# Altium project mini_backplane_simple.PrjPcb
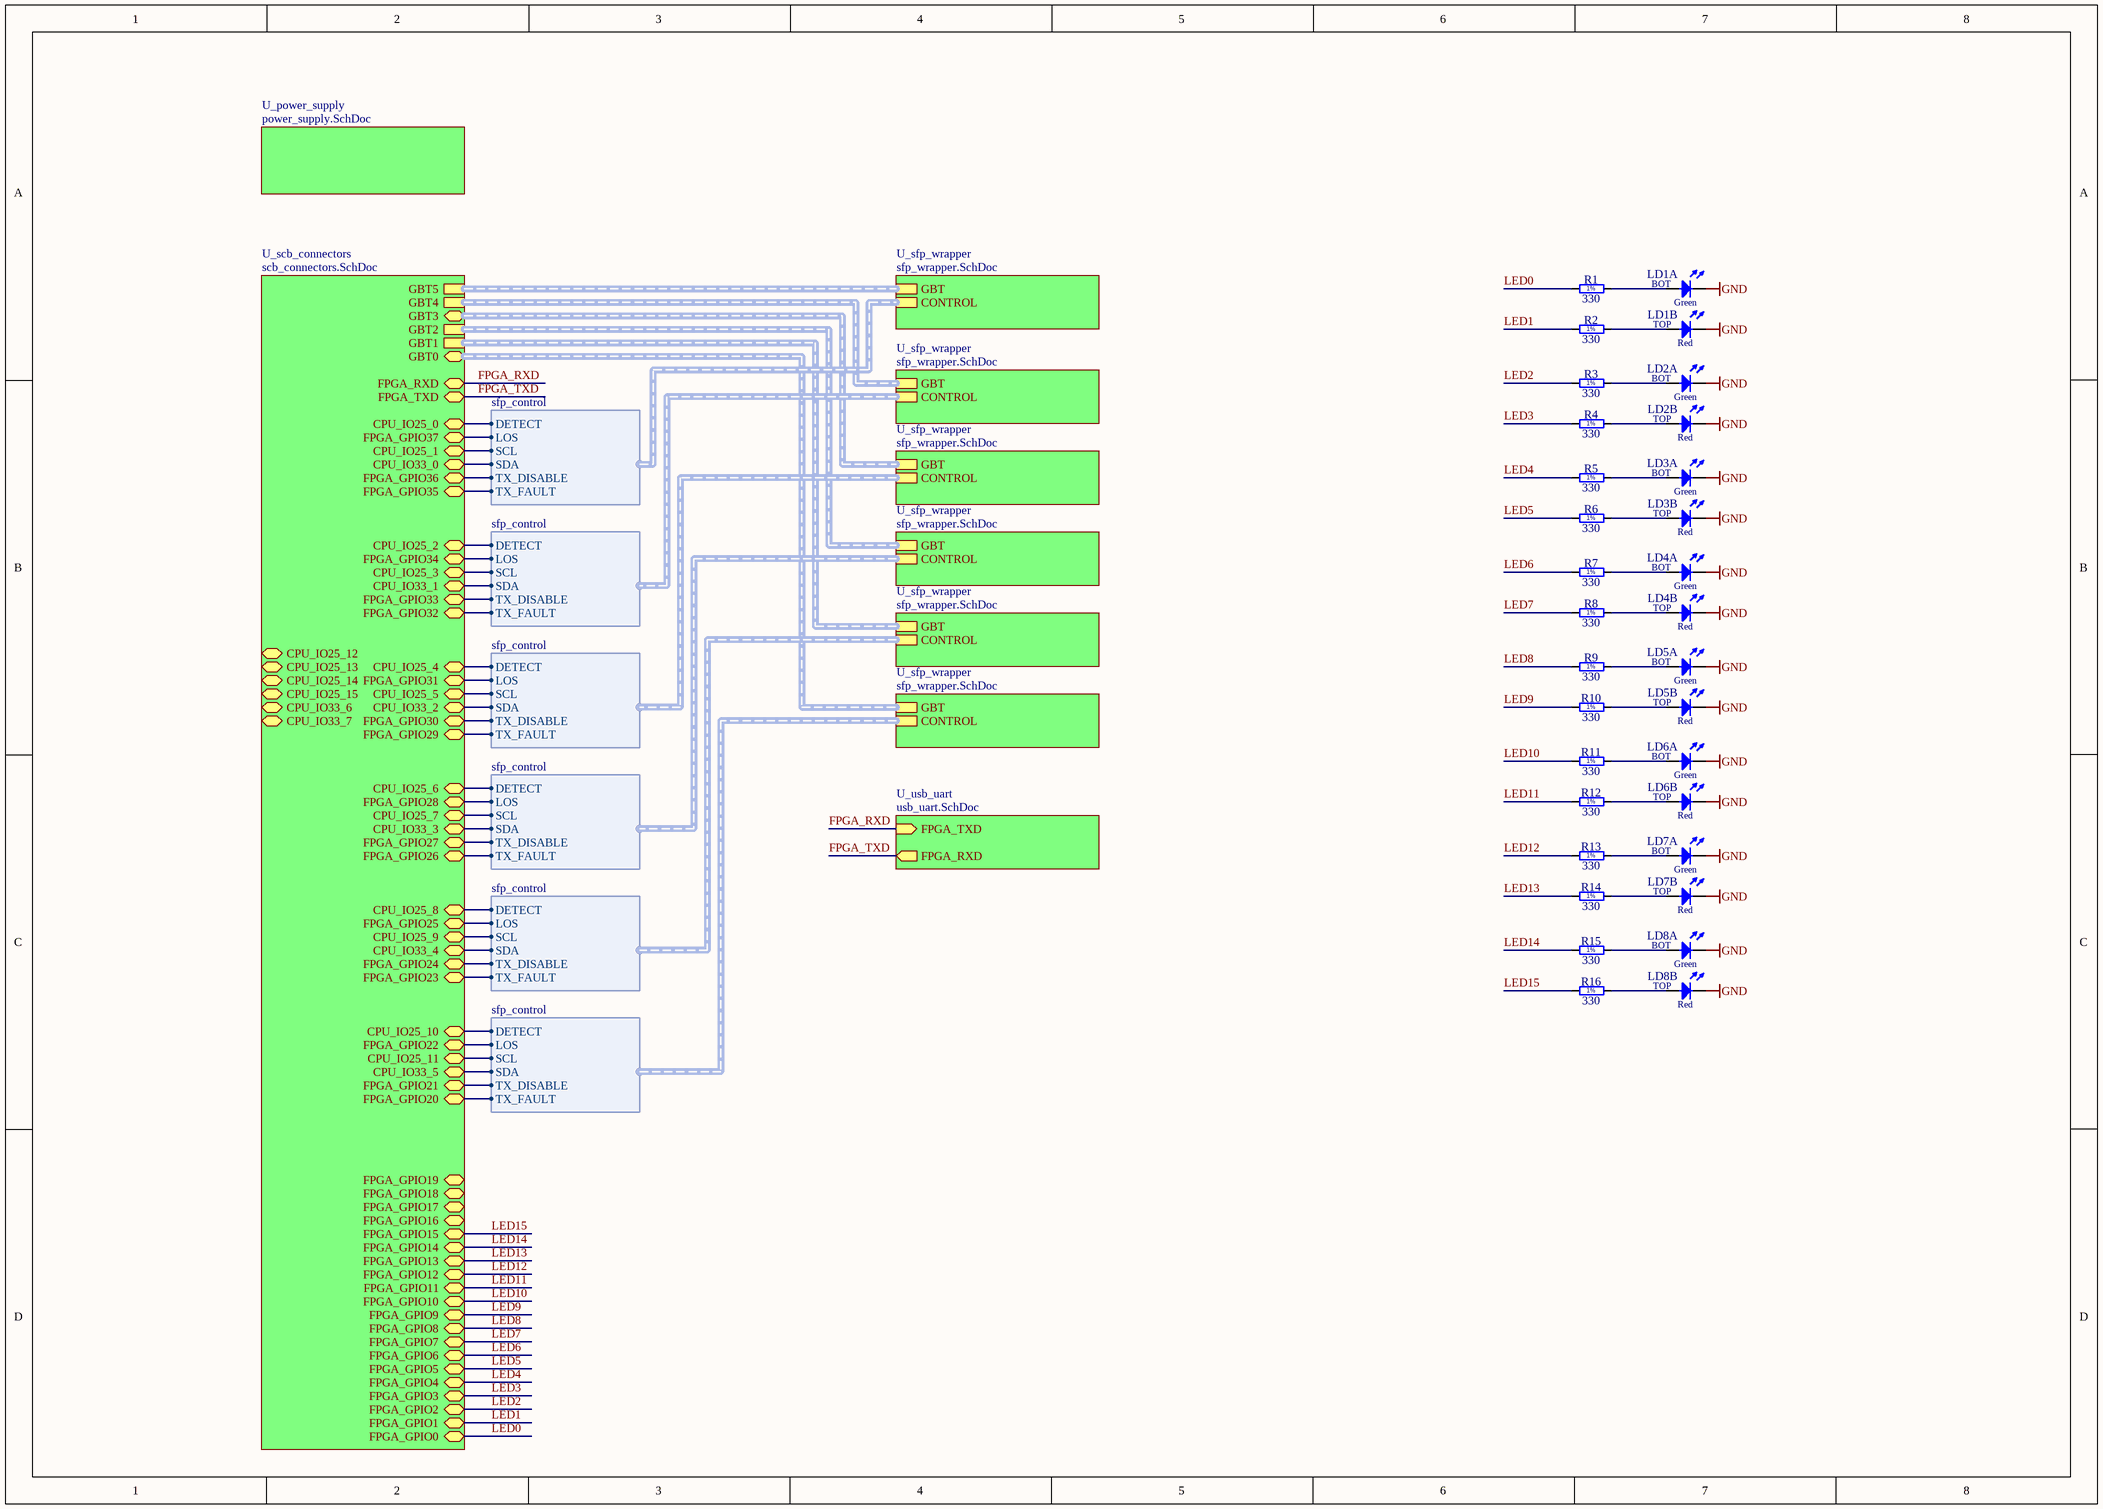
[diagram p0: mini_backplane.SchDoc]
Projet: Simple mini-backplane for V3 SCB; DivGrp: BE-CO
5 sheets, 147 parts. Net scope: hierarchical (ports join the sheet entries above them; power ports are global).
Board file: mini_backplane.PcbDoc
Sheets:
  mini_backplane.SchDoc
    U_power_supply = power_supply.SchDoc
    U_scb_connectors = scb_connectors.SchDoc
    U_sfp_wrapper = sfp_wrapper.SchDoc
    U_sfp_wrapper = sfp_wrapper.SchDoc
    U_sfp_wrapper = sfp_wrapper.SchDoc
    U_sfp_wrapper = sfp_wrapper.SchDoc
    U_sfp_wrapper = sfp_wrapper.SchDoc
    U_sfp_wrapper = sfp_wrapper.SchDoc
    U_usb_uart = usb_uart.SchDoc

## Sheet mini_backplane.SchDoc
size A3

### Parts
LD1  Red/Green  [LED_DIALIGHT_571-0112-100F]  (value not drawn)  (parts A,B of 2)
LD2  Red/Green  [LED_DIALIGHT_571-0112-100F]  (value not drawn)  (parts A,B of 2)
LD3  Red/Green  [LED_DIALIGHT_571-0112-100F]  (value not drawn)  (parts A,B of 2)
LD4  Red/Green  [LED_DIALIGHT_571-0112-100F]  (value not drawn)  (parts A,B of 2)
LD5  Red/Green  [LED_DIALIGHT_571-0112-100F]  (value not drawn)  (parts A,B of 2)
LD6  Red/Green  [LED_DIALIGHT_571-0112-100F]  (value not drawn)  (parts A,B of 2)
LD7  Red/Green  [LED_DIALIGHT_571-0112-100F]  (value not drawn)  (parts A,B of 2)
LD8  Red/Green  [LED_DIALIGHT_571-0112-100F]  (value not drawn)  (parts A,B of 2)
R1  330  [RESC1608X55N]
R2  330  [RESC1608X55N]
R3  330  [RESC1608X55N]
R4  330  [RESC1608X55N]
R5  330  [RESC1608X55N]
R6  330  [RESC1608X55N]
R7  330  [RESC1608X55N]
R8  330  [RESC1608X55N]
R9  330  [RESC1608X55N]
R10  330  [RESC1608X55N]
R11  330  [RESC1608X55N]
R12  330  [RESC1608X55N]
R13  330  [RESC1608X55N]
R14  330  [RESC1608X55N]
R15  330  [RESC1608X55N]
R16  330  [RESC1608X55N]

### Sub-sheets
U_power_supply = power_supply.SchDoc: no entries
U_scb_connectors = scb_connectors.SchDoc: FPGA_GPIO0 (bidir), FPGA_GPIO1 (bidir), FPGA_GPIO2 (bidir), FPGA_GPIO3 (bidir), FPGA_GPIO4 (bidir), FPGA_GPIO5 (bidir), FPGA_GPIO6 (bidir), FPGA_GPIO7 (bidir), FPGA_GPIO8 (bidir), FPGA_GPIO9 (bidir), FPGA_GPIO10 (bidir), FPGA_GPIO11 (bidir), FPGA_GPIO12 (bidir), FPGA_GPIO13 (bidir), FPGA_GPIO14 (bidir), FPGA_GPIO15 (bidir), FPGA_GPIO16 (bidir), FPGA_GPIO17 (bidir), FPGA_GPIO18 (bidir), FPGA_GPIO19 (bidir), FPGA_GPIO20 (bidir), FPGA_GPIO21 (bidir), FPGA_GPIO22 (bidir), FPGA_GPIO23 (bidir), FPGA_GPIO24 (bidir), FPGA_GPIO25 (bidir), FPGA_GPIO26 (bidir), FPGA_GPIO27 (bidir), FPGA_GPIO28 (bidir), FPGA_GPIO29 (bidir), FPGA_GPIO30 (bidir), FPGA_GPIO31 (bidir), FPGA_GPIO32 (bidir), FPGA_GPIO33 (bidir), FPGA_GPIO34 (bidir), FPGA_GPIO35 (bidir), FPGA_GPIO36 (bidir), FPGA_GPIO37 (bidir), GBT1 (harness sfp_gbit), GBT2 (harness sfp_gbit), GBT4 (harness sfp_gbit), GBT5 (harness sfp_gbit), FPGA_RXD (bidir), FPGA_TXD (bidir), GBT0 (harness sfp_gbit), GBT3 (harness sfp_gbit), CPU_IO25_0 (bidir), CPU_IO25_1 (bidir), CPU_IO25_2 (bidir), CPU_IO25_3 (bidir), CPU_IO25_4 (bidir), CPU_IO25_5 (bidir), CPU_IO25_6 (bidir), CPU_IO25_7 (bidir), CPU_IO25_8 (bidir), CPU_IO25_9 (bidir), CPU_IO25_10 (bidir), CPU_IO25_11 (bidir), CPU_IO25_12 (bidir), CPU_IO25_13 (bidir), CPU_IO25_14 (bidir), CPU_IO25_15 (bidir), CPU_IO33_0 (bidir), CPU_IO33_1 (bidir), CPU_IO33_2 (bidir), CPU_IO33_3 (bidir), CPU_IO33_4 (bidir), CPU_IO33_5 (bidir), CPU_IO33_6 (bidir), CPU_IO33_7 (bidir)
U_sfp_wrapper = sfp_wrapper.SchDoc: GBT (harness sfp_gbit), CONTROL (harness sfp_control)
U_sfp_wrapper = sfp_wrapper.SchDoc: GBT (harness sfp_gbit), CONTROL (harness sfp_control)
U_sfp_wrapper = sfp_wrapper.SchDoc: GBT (harness sfp_gbit), CONTROL (harness sfp_control)
U_sfp_wrapper = sfp_wrapper.SchDoc: GBT (harness sfp_gbit), CONTROL (harness sfp_control)
U_sfp_wrapper = sfp_wrapper.SchDoc: GBT (harness sfp_gbit), CONTROL (harness sfp_control)
U_sfp_wrapper = sfp_wrapper.SchDoc: GBT (harness sfp_gbit), CONTROL (harness sfp_control)
U_usb_uart = usb_uart.SchDoc: FPGA_RXD (out), FPGA_TXD (in)

### Harnesses
sfp_control: DETECT, LOS, SCL, SDA, TX_DISABLE, TX_FAULT

### Nets
GND: LD1.1(C) LD1.3(C) LD2.1(C) LD2.3(C) LD3.1(C) LD3.3(C) LD4.1(C) LD4.3(C) LD5.1(C) LD5.3(C) LD6.1(C) LD6.3(C) LD7.1(C) LD7.3(C) LD8.1(C) LD8.3(C)
DETECT: sheet U_scb_connectors/CPU_IO25_0, sheet U_sfp_wrapper/CONTROL.DETECT
DETECT: sheet U_scb_connectors/CPU_IO25_2, sheet U_sfp_wrapper/CONTROL.DETECT  [a separate net that carries the same name]
DETECT: sheet U_scb_connectors/CPU_IO25_4, sheet U_sfp_wrapper/CONTROL.DETECT  [a separate net that carries the same name]
DETECT: sheet U_scb_connectors/CPU_IO25_6, sheet U_sfp_wrapper/CONTROL.DETECT  [a separate net that carries the same name]
DETECT: sheet U_scb_connectors/CPU_IO25_8, sheet U_sfp_wrapper/CONTROL.DETECT  [a separate net that carries the same name]
DETECT: sheet U_scb_connectors/CPU_IO25_10, sheet U_sfp_wrapper/CONTROL.DETECT  [a separate net that carries the same name]
FPGA_GPIO20: sheet U_scb_connectors/FPGA_GPIO20, sheet U_sfp_wrapper/CONTROL.TX_FAULT
FPGA_GPIO21: sheet U_scb_connectors/FPGA_GPIO21, sheet U_sfp_wrapper/CONTROL.TX_DISABLE
FPGA_GPIO22: sheet U_scb_connectors/FPGA_GPIO22, sheet U_sfp_wrapper/CONTROL.LOS
FPGA_GPIO23: sheet U_scb_connectors/FPGA_GPIO23, sheet U_sfp_wrapper/CONTROL.TX_FAULT
FPGA_GPIO24: sheet U_scb_connectors/FPGA_GPIO24, sheet U_sfp_wrapper/CONTROL.TX_DISABLE
FPGA_GPIO25: sheet U_scb_connectors/FPGA_GPIO25, sheet U_sfp_wrapper/CONTROL.LOS
FPGA_GPIO26: sheet U_scb_connectors/FPGA_GPIO26, sheet U_sfp_wrapper/CONTROL.TX_FAULT
FPGA_GPIO27: sheet U_scb_connectors/FPGA_GPIO27, sheet U_sfp_wrapper/CONTROL.TX_DISABLE
FPGA_GPIO28: sheet U_scb_connectors/FPGA_GPIO28, sheet U_sfp_wrapper/CONTROL.LOS
FPGA_GPIO29: sheet U_scb_connectors/FPGA_GPIO29, sheet U_sfp_wrapper/CONTROL.TX_FAULT
FPGA_GPIO30: sheet U_scb_connectors/FPGA_GPIO30, sheet U_sfp_wrapper/CONTROL.TX_DISABLE
FPGA_GPIO31: sheet U_scb_connectors/FPGA_GPIO31, sheet U_sfp_wrapper/CONTROL.LOS
FPGA_GPIO32: sheet U_scb_connectors/FPGA_GPIO32, sheet U_sfp_wrapper/CONTROL.TX_FAULT
FPGA_GPIO33: sheet U_scb_connectors/FPGA_GPIO33, sheet U_sfp_wrapper/CONTROL.TX_DISABLE
FPGA_GPIO34: sheet U_scb_connectors/FPGA_GPIO34, sheet U_sfp_wrapper/CONTROL.LOS
FPGA_GPIO35: sheet U_scb_connectors/FPGA_GPIO35, sheet U_sfp_wrapper/CONTROL.TX_FAULT
FPGA_GPIO36: sheet U_scb_connectors/FPGA_GPIO36, sheet U_sfp_wrapper/CONTROL.TX_DISABLE
FPGA_GPIO37: sheet U_scb_connectors/FPGA_GPIO37, sheet U_sfp_wrapper/CONTROL.LOS
FPGA_RXD: sheet U_scb_connectors/FPGA_RXD, sheet U_usb_uart/FPGA_TXD
FPGA_TXD: sheet U_scb_connectors/FPGA_TXD, sheet U_usb_uart/FPGA_RXD
LED0: R1.1 ; sheet U_scb_connectors/FPGA_GPIO0  [project net FPGA_GPIO0]
LED1: R2.1 ; sheet U_scb_connectors/FPGA_GPIO1  [project net FPGA_GPIO1]
LED2: R3.1 ; sheet U_scb_connectors/FPGA_GPIO2  [project net FPGA_GPIO2]
LED3: R4.1 ; sheet U_scb_connectors/FPGA_GPIO3  [project net FPGA_GPIO3]
LED4: R5.1 ; sheet U_scb_connectors/FPGA_GPIO4  [project net FPGA_GPIO4]
LED5: R6.1 ; sheet U_scb_connectors/FPGA_GPIO5  [project net FPGA_GPIO5]
LED6: R7.1 ; sheet U_scb_connectors/FPGA_GPIO6  [project net FPGA_GPIO6]
LED7: R8.1 ; sheet U_scb_connectors/FPGA_GPIO7  [project net FPGA_GPIO7]
LED8: R9.1 ; sheet U_scb_connectors/FPGA_GPIO8  [project net FPGA_GPIO8]
LED9: R10.1 ; sheet U_scb_connectors/FPGA_GPIO9  [project net FPGA_GPIO9]
LED10: R11.1 ; sheet U_scb_connectors/FPGA_GPIO10  [project net FPGA_GPIO10]
LED11: R12.1 ; sheet U_scb_connectors/FPGA_GPIO11  [project net FPGA_GPIO11]
LED12: R13.1 ; sheet U_scb_connectors/FPGA_GPIO12  [project net FPGA_GPIO12]
LED13: R14.1 ; sheet U_scb_connectors/FPGA_GPIO13  [project net FPGA_GPIO13]
LED14: R15.1 ; sheet U_scb_connectors/FPGA_GPIO14  [project net FPGA_GPIO14]
LED15: R16.1 ; sheet U_scb_connectors/FPGA_GPIO15  [project net FPGA_GPIO15]
PB0: sheet U_scb_connectors/CPU_IO33_4, sheet U_sfp_wrapper/CONTROL.SDA
PB1: sheet U_scb_connectors/CPU_IO33_2, sheet U_sfp_wrapper/CONTROL.SDA
PB2: sheet U_scb_connectors/CPU_IO33_3, sheet U_sfp_wrapper/CONTROL.SDA
PB3: sheet U_scb_connectors/CPU_IO33_1, sheet U_sfp_wrapper/CONTROL.SDA
PB4: sheet U_scb_connectors/CPU_IO33_5, sheet U_sfp_wrapper/CONTROL.SDA
PB6: sheet U_scb_connectors/CPU_IO33_0, sheet U_sfp_wrapper/CONTROL.SDA
PE4: sheet U_scb_connectors/CPU_IO25_5, sheet U_sfp_wrapper/CONTROL.SCL
PE5: sheet U_scb_connectors/CPU_IO25_9, sheet U_sfp_wrapper/CONTROL.SCL
PE6: sheet U_scb_connectors/CPU_IO25_11, sheet U_sfp_wrapper/CONTROL.SCL
PE11: sheet U_scb_connectors/CPU_IO25_7, sheet U_sfp_wrapper/CONTROL.SCL
PE12: sheet U_scb_connectors/CPU_IO25_1, sheet U_sfp_wrapper/CONTROL.SCL
PE13: sheet U_scb_connectors/CPU_IO25_3, sheet U_sfp_wrapper/CONTROL.SCL
NetLD1_2: LD1.2(A) R1.2
NetLD1_4: LD1.4(A) R2.2
NetLD2_2: LD2.2(A) R3.2
NetLD2_4: LD2.4(A) R4.2
NetLD3_2: LD3.2(A) R5.2
NetLD3_4: LD3.4(A) R6.2
NetLD4_2: LD4.2(A) R7.2
NetLD4_4: LD4.4(A) R8.2
NetLD5_2: LD5.2(A) R9.2
NetLD5_4: LD5.4(A) R10.2
NetLD6_2: LD6.2(A) R11.2
NetLD6_4: LD6.4(A) R12.2
NetLD7_2: LD7.2(A) R13.2
NetLD7_4: LD7.4(A) R14.2
NetLD8_2: LD8.2(A) R15.2
NetLD8_4: LD8.4(A) R16.2

### Buses and harness runs
harness sheet U_scb_connectors/GBT0 = sheet U_sfp_wrapper/GBT
harness sheet U_scb_connectors/GBT1 = sheet U_sfp_wrapper/GBT
harness sheet U_scb_connectors/GBT2 = sheet U_sfp_wrapper/GBT
harness sheet U_scb_connectors/GBT3 = sheet U_sfp_wrapper/GBT
harness sheet U_scb_connectors/GBT4 = sheet U_sfp_wrapper/GBT
harness sheet U_scb_connectors/GBT5 = sheet U_sfp_wrapper/GBT

### Notes on the sheet
- (in symbol LED_DIALIGHT_571-0112-100F, part A) BOT; Green
- (in symbol LED_DIALIGHT_571-0112-100F, part B) TOP; Red
- (in symbol R0603_330R_1%_0.1W_100PPM) 1%

### Library data of the parts
LD1-LD8 = LED_DIALIGHT_571-0112-100F: 2x LED  Botom Green, Top Red; Part Description: Dual 2mm  LEDs, Red Top,Green Bot, CBI® Circuit Board Indicator (With positioning pins); Table: LEDs & Displays; Part Number: LED_DIALIGHT_571-0112-100F; Component Kind: Standard; Component Type: Standard; Color: Red/Green; PackageDescription: 2x 2mm LED (Top: Red, Bot: Green) PCB Edge Mounting (With positioning pins) DIALIGHT 571 Serie; Manufacturer: DIALIGHT; Manufacturer Part Number: 571-0112-100F; Pin Count: 4; Mounted: Yes; Socket: No; SMD: No; ComponentHeight: 8.6mm; HelpURL: \\cern.ch\dfs\Applications\Altium\Datasheets\LED_DIALIGHT_571-0112-100F.pdf; Author: CERN DEM JLC; CreateDate: 11/5/2009; LatestRevisionDate: 3/17/2010
R1-R16 = R0603_330R_1%_0.1W_100PPM: Resistor - 1%; Part Description: General Purpose Thick Film Chip Resistor; Manufacturer: GENERIC; Manufacturer1 Part Number: NRC06F3300TRF; Power: 0.1W; TC: ±100ppm/°C; Table: Resistors SMD; Part Number: R0603_330R_1%_0.1W_100PPM; Component Kind: Standard; Component Type: Standard; Pin Count: 2; Value: 330; Status: Preferred; Tolerance: ±1%; Manufacturer Part Number: R0603_330R_1%_0.1W_100PPM; Case: 0603; Mounted: Yes; Socket: No; SMD: Yes; Manufacturer1 Example: NIC COMPONENT; Manufacturer1 ComponentHeight: 0.55mm; HelpURL: \\cern.ch\dfs\Applications\Altium\Datasheets\R0603_NIC_NRC.pdf; Author: CERN DEM JLC; CreateDate: 12/3/2007; LatestRevisionDate: 3/13/2008

## Sheet power_supply.SchDoc
size A
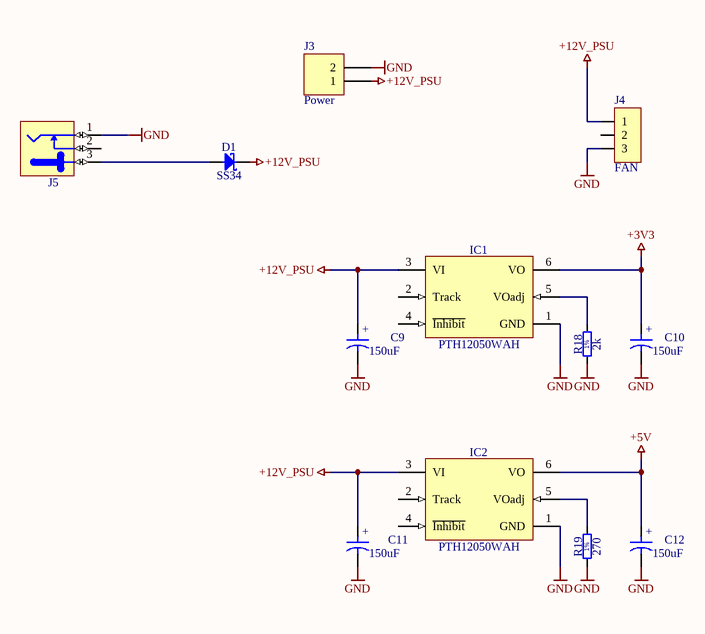
[diagram p1: power_supply.SchDoc]

### Parts
C9  150uF  [CAPPR500-1050X800]
C10  150uF  [CAPPR350-850X700]
C11  150uF  [CAPPR500-1050X800]
C12  150uF  [CAPPR350-850X700]
D1  SS34  [DIOM7659X265N]
IC1  PTH12050WAH  [TEXAS_EUU (R-PDSS-T6)]
IC2  PTH12050WAH  [TEXAS_EUU (R-PDSS-T6)]
J3  Power  [CON_3.96_2]
J4  FAN  [SIP3]
J5  Jack  [LUMBERG_161314]  (value not drawn)
R18  2k  [RESC2012X60N]
R19  270  [RESC2012X60N]

### Nets
+3V3: C10.1 IC1.6(VO)
+5V: C12.1 IC2.6(VO)
+12V_PSU: C9.1 C11.1 D1.1(C) IC1.3(VI) IC2.3(VI) J3.1 J4.1
GND: C9.2 C10.2 C11.2 C12.2 IC1.1(GND) IC2.1(GND) J3.2 J4.3 J5.1 R18.1 R19.1
NetD1_2: D1.2(A) J5.3
NetIC1_5: IC1.5(VOadj) R18.2
NetIC2_5: IC2.5(VOadj) R19.2

Not connected (* = marked no-connect by the designer): IC1 2(Track) 4(~{Inhibit}); IC2 2(Track) 4(~{Inhibit}); J4 2; J5 2

### Notes on the sheet
- (in symbol CAER_150UF_6.3V_20%_SANYO_6SEQP150M) +
- (in symbol CAER_150UF_16V_20%_SANYO_16SEQP150M) +
- (in symbol R0805_2K_1%_0.125W_100PPM) 1%
- (in symbol R0805_270R_1%_0.125W_100PPM) 1%

### Library data of the parts
C9 C11 = CAER_150UF_16V_20%_SANYO_16SEQP150M: Polarised capacitor; Part Description: Aluminium Solid Capacitor With Conductive Polymer (SEQP Serie); Manufacturer: SANYO OS-CON; Voltage: 16V; Tolerance: ±20%; Table: Capacitors THD; Part Number: CAER_150UF_16V_20%_SANYO_16SEQP150M; Component Kind: Standard; Component Type: Standard; Pin Count: 2; Value: 150uF; Status: Not Recommended; Manufacturer Part Number: 16SEQP150M; Case: LS5 D10 x H8; Mounted: Yes; Socket: No; SMD: No; ComponentHeight: 8mm; HelpURL: \\cern.ch\dfs\Applications\Altium\Datasheets\CAER_SANYO_SEQP.pdf; Author: CERN DEM JLC; CreateDate: 3/7/2011; LatestRevisionDate: 3/7/2011
C10 C12 = CAER_150UF_6.3V_20%_SANYO_6SEQP150M: Polarised capacitor; Part Description: Aluminium Solid Capacitor With Conductive Polymer (SEQP Serie); Manufacturer: SANYO OS-CON; Voltage: 6.3V; Tolerance: ±20%; Table: Capacitors THD; Part Number: CAER_150UF_6.3V_20%_SANYO_6SEQP150M; Component Kind: Standard; Component Type: Standard; Pin Count: 2; Value: 150uF; Status: Not Recommended; Manufacturer Part Number: 6SEQP150M; Case: LS3.5 D8 x H7; Mounted: Yes; Socket: No; SMD: No; ComponentHeight: 7mm; HelpURL: \\cern.ch\dfs\Applications\Altium\Datasheets\CAER_SANYO_SEQP.pdf; Author: CERN DEM JLC; CreateDate: 3/7/2011; LatestRevisionDate: 3/7/2011
D1 = SS34: Schottky Diode; Part Description: Surface Mount Schottky Barrier Rectifier; Manufacturer: FAIRCHILD SEMICONDUCTOR; Voltage: 40V; Power: 3A; Table: Diodes; Part Number: SS34; Component Kind: Standard; Component Type: Standard; Device: SS34; PackageDescription: DO-214-AB/SMC Molded Diode, Body 7.95x5.9mm, IPC Medium Density; Manufacturer Part Number: SS34; Pin Count: 2; Case: DO-214AC; Mounted: Yes; Socket: No; SMD: Yes; ComponentHeight: 2.65mm; HelpURL: \\cern.ch\dfs\Applications\Altium\Datasheets\SS34.pdf; Author: CERN DEM JLC; CreateDate: 8/23/2010; LatestRevisionDate: 8/23/2010
IC1 IC2 = PTH12050WAH: 6-A, 12-V Input, Non-Isolated, Wide-Output 1.2V to 5.5V, Adjustable Power Modue; Part Description: 6A, 12-V Input, Non-Isolated, Wide-Output 1.2V to 5.5V, Adjustable Power Module; Manufacturer: TEXAS INSTRUMENTS; Table: Regulators; Part Number: PTH12050WAH; Component Kind: Standard; Component Type: Standard; Device: PTH12050WAH; PackageDescription: Texas TEXAS_EUU (R-PDSS-T6) Case; Manufacturer Part Number: PTH12050WAH; Pin Count: 6; Mounted: Yes; Socket: No; SMD: No; ComponentHeight: 8.5mm; HelpURL: \\cern.ch\dfs\Applications\Altium\Datasheets\PTH12050WAH.pdf; Author: CERN DEM JLC; CreateDate: 7/7/2010; LatestRevisionDate: 7/7/2010
J3 = Header 2: Header, 2-Pin; LatestRevisionDate: 17-Jul-2002; LatestRevisionNote: Re-released for DXP Platform.; Publisher: Altium Limited
J4 = CON3: Connector
J5 = LUMBERG_161314: 24V /3. 5A, 2.1mm Diameter Pin, SMD DC Power Supply Connector With  Break Contact; Manufacturer Part Number: 161314; Table: Miscellaneous; Part Number: LUMBERG_161314; Component Kind: Standard; Component Type: Standard; Pin Count: 3; Family: Jack; Mounted: Yes; Socket: No; SMD: No; Status: None; Part Description: 24V/3. 5A, 2.1mm Diameter Pin, SMD DC Power Supply Connector With  Break Contact; Manufacturer: LUMBERG; ComponentHeight: 11mm; HelpURL: \\cern.ch\dfs\Applications\Altium\Datasheets\LUMBERG_161314.pdf; Author: CERN DEM JLC; CreateDate: 2/15/2011; LatestRevisionDate: 3/2/2011
R18 = R0805_2K_1%_0.125W_100PPM: Resistor - 1%; Part Description: General Purpose Thick Film Chip Resistor; Manufacturer: GENERIC; Manufacturer1 Part Number: NRC10F2001TRF; Power: 0.125W; TC: ±100ppm/°C; Table: Resistors SMD; Part Number: R0805_2K_1%_0.125W_100PPM; Component Kind: Standard; Component Type: Standard; Pin Count: 2; Value: 2k; Status: Preferred; Tolerance: ±1%; Manufacturer Part Number: R0805_2K_1%_0.125W_100PPM; Case: 0805; Mounted: Yes; Socket: No; SMD: Yes; Manufacturer1 Example: NIC COMPONENT; Manufacturer1 ComponentHeight: 0.6mm; HelpURL: \\cern.ch\dfs\Applications\Altium\Datasheets\R0805_NIC_NRC.pdf; Author: CERN DEM JLC; CreateDate: 12/3/2007; LatestRevisionDate: 3/13/2008
R19 = R0805_270R_1%_0.125W_100PPM: Resistor - 1%; Part Description: General Purpose Thick Film Chip Resistor; Manufacturer: GENERIC; Manufacturer1 Part Number: NRC10F2700TRF; Power: 0.125W; TC: ±100ppm/°C; Table: Resistors SMD; Part Number: R0805_270R_1%_0.125W_100PPM; Component Kind: Standard; Component Type: Standard; Pin Count: 2; Value: 270; Status: Preferred; Tolerance: ±1%; Manufacturer Part Number: R0805_270R_1%_0.125W_100PPM; Case: 0805; Mounted: Yes; Socket: No; SMD: Yes; Manufacturer1 Example: NIC COMPONENT; Manufacturer1 ComponentHeight: 0.6mm; HelpURL: \\cern.ch\dfs\Applications\Altium\Datasheets\R0805_NIC_NRC.pdf; Author: CERN DEM JLC; CreateDate: 12/3/2007; LatestRevisionDate: 3/13/2008

## Sheet scb_connectors.SchDoc
size A3
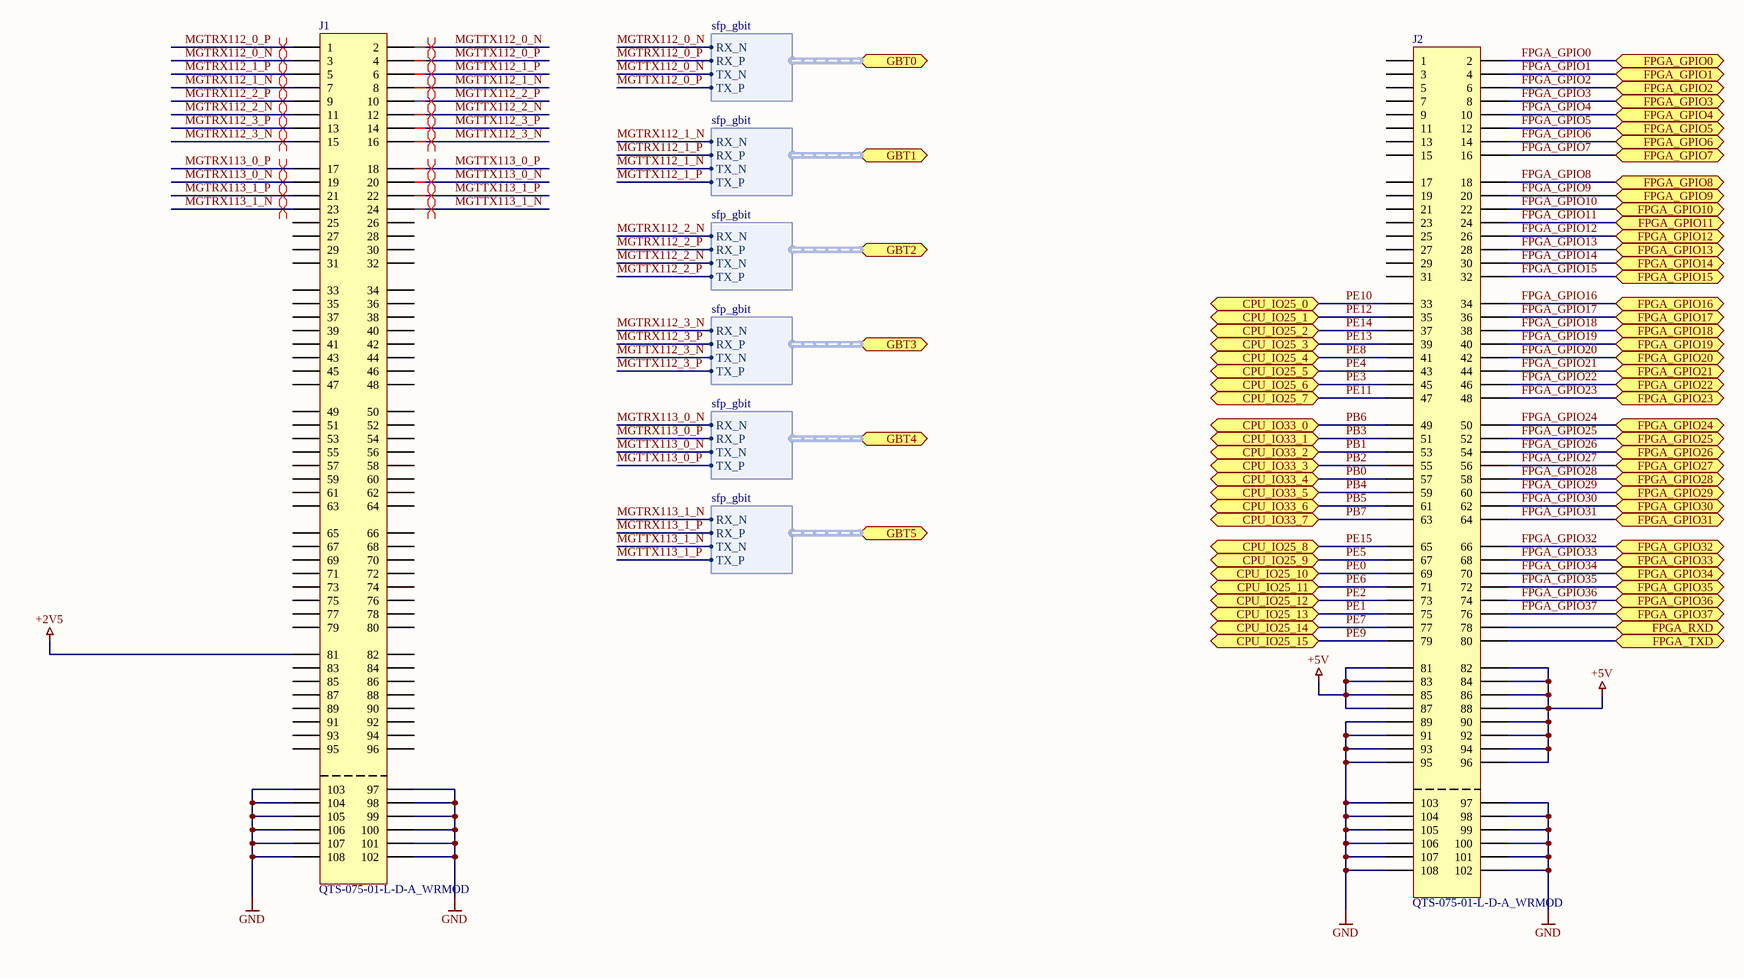
[diagram p2: scb_connectors.SchDoc]

### Parts
J1  QTS-075-01-L-D-A_WRMOD  [QTS-075-01-L-D-A_WRMOD]
J2  QTS-075-01-L-D-A_WRMOD  [QTS-075-01-L-D-A_WRMOD]

### Ports
CPU_IO25_0 (bidir), CPU_IO25_1 (bidir), CPU_IO25_2 (bidir), CPU_IO25_3 (bidir), CPU_IO25_4 (bidir), CPU_IO25_5 (bidir), CPU_IO25_6 (bidir), CPU_IO25_7 (bidir), CPU_IO25_8 (bidir), CPU_IO25_9 (bidir), CPU_IO25_10 (bidir), CPU_IO25_11 (bidir), CPU_IO25_12 (bidir), CPU_IO25_13 (bidir), CPU_IO25_14 (bidir), CPU_IO25_15 (bidir), CPU_IO33_0 (bidir), CPU_IO33_1 (bidir), CPU_IO33_2 (bidir), CPU_IO33_3 (bidir), CPU_IO33_4 (bidir), CPU_IO33_5 (bidir), CPU_IO33_6 (bidir), CPU_IO33_7 (bidir), FPGA_GPIO0 (bidir), FPGA_GPIO1 (bidir), FPGA_GPIO2 (bidir), FPGA_GPIO3 (bidir), FPGA_GPIO4 (bidir), FPGA_GPIO5 (bidir), FPGA_GPIO6 (bidir), FPGA_GPIO7 (bidir), FPGA_GPIO8 (bidir), FPGA_GPIO9 (bidir), FPGA_GPIO10 (bidir), FPGA_GPIO11 (bidir), FPGA_GPIO12 (bidir), FPGA_GPIO13 (bidir), FPGA_GPIO14 (bidir), FPGA_GPIO15 (bidir), FPGA_GPIO16 (bidir), FPGA_GPIO17 (bidir), FPGA_GPIO18 (bidir), FPGA_GPIO19 (bidir), FPGA_GPIO20 (bidir), FPGA_GPIO21 (bidir), FPGA_GPIO22 (bidir), FPGA_GPIO23 (bidir), FPGA_GPIO24 (bidir), FPGA_GPIO25 (bidir), FPGA_GPIO26 (bidir), FPGA_GPIO27 (bidir), FPGA_GPIO28 (bidir), FPGA_GPIO29 (bidir), FPGA_GPIO30 (bidir), FPGA_GPIO31 (bidir), FPGA_GPIO32 (bidir), FPGA_GPIO33 (bidir), FPGA_GPIO34 (bidir), FPGA_GPIO35 (bidir), FPGA_GPIO36 (bidir), FPGA_GPIO37 (bidir), FPGA_RXD (bidir), FPGA_TXD (bidir), GBT0 (harness sfp_gbit), GBT1 (harness sfp_gbit), GBT2 (harness sfp_gbit), GBT3 (harness sfp_gbit), GBT4 (harness sfp_gbit), GBT5 (harness sfp_gbit)

### Harnesses
sfp_gbit: RX_N, RX_P, TX_N, TX_P

### Nets
+2V5: J1.81
+5V: J2.81 J2.82 J2.83 J2.84 J2.85 J2.86 J2.87 J2.88 J2.90 J2.92 J2.94 J2.96
GND: J1.97 J1.98 J1.99 J1.100 J1.101 J1.102 J1.103 J1.104 J1.105 J1.106 J1.107 J1.108 J2.89 J2.91 J2.93 J2.95 J2.97 J2.98 J2.99 J2.100 J2.101 J2.102 J2.103 J2.104 J2.105 J2.106 J2.107 J2.108
FPGA_GPIO0: J2.2 ; port FPGA_GPIO0
FPGA_GPIO1: J2.4 ; port FPGA_GPIO1
FPGA_GPIO2: J2.6 ; port FPGA_GPIO2
FPGA_GPIO3: J2.8 ; port FPGA_GPIO3
FPGA_GPIO4: J2.10 ; port FPGA_GPIO4
FPGA_GPIO5: J2.12 ; port FPGA_GPIO5
FPGA_GPIO6: J2.14 ; port FPGA_GPIO6
FPGA_GPIO7: J2.16 ; port FPGA_GPIO7
FPGA_GPIO8: J2.18 ; port FPGA_GPIO8
FPGA_GPIO9: J2.20 ; port FPGA_GPIO9
FPGA_GPIO10: J2.22 ; port FPGA_GPIO10
FPGA_GPIO11: J2.24 ; port FPGA_GPIO11
FPGA_GPIO12: J2.26 ; port FPGA_GPIO12
FPGA_GPIO13: J2.28 ; port FPGA_GPIO13
FPGA_GPIO14: J2.30 ; port FPGA_GPIO14
FPGA_GPIO15: J2.32 ; port FPGA_GPIO15
FPGA_GPIO16: J2.34 ; port FPGA_GPIO16
FPGA_GPIO17: J2.36 ; port FPGA_GPIO17
FPGA_GPIO18: J2.38 ; port FPGA_GPIO18
FPGA_GPIO19: J2.40 ; port FPGA_GPIO19
FPGA_GPIO20: J2.42 ; port FPGA_GPIO20
FPGA_GPIO21: J2.44 ; port FPGA_GPIO21
FPGA_GPIO22: J2.46 ; port FPGA_GPIO22
FPGA_GPIO23: J2.48 ; port FPGA_GPIO23
FPGA_GPIO24: J2.50 ; port FPGA_GPIO24
FPGA_GPIO25: J2.52 ; port FPGA_GPIO25
FPGA_GPIO26: J2.54 ; port FPGA_GPIO26
FPGA_GPIO27: J2.56 ; port FPGA_GPIO27
FPGA_GPIO28: J2.58 ; port FPGA_GPIO28
FPGA_GPIO29: J2.60 ; port FPGA_GPIO29
FPGA_GPIO30: J2.62 ; port FPGA_GPIO30
FPGA_GPIO31: J2.64 ; port FPGA_GPIO31
FPGA_GPIO32: J2.66 ; port FPGA_GPIO32
FPGA_GPIO33: J2.68 ; port FPGA_GPIO33
FPGA_GPIO34: J2.70 ; port FPGA_GPIO34
FPGA_GPIO35: J2.72 ; port FPGA_GPIO35
FPGA_GPIO36: J2.74 ; port FPGA_GPIO36
FPGA_GPIO37: J2.76 ; port FPGA_GPIO37
FPGA_RXD: J2.78 ; port FPGA_RXD
FPGA_TXD: J2.80 ; port FPGA_TXD
MGTRX112_0_N: J1.3 ; port GBT0.RX_N
MGTRX112_0_P: J1.1 ; port GBT0.RX_P
MGTRX112_1_N: J1.7 ; port GBT1.RX_N
MGTRX112_1_P: J1.5 ; port GBT1.RX_P
MGTRX112_2_N: J1.11 ; port GBT2.RX_N
MGTRX112_2_P: J1.9 ; port GBT2.RX_P
MGTRX112_3_N: J1.15 ; port GBT3.RX_N
MGTRX112_3_P: J1.13 ; port GBT3.RX_P
MGTRX113_0_N: J1.19 ; port GBT4.RX_N
MGTRX113_0_P: J1.17 ; port GBT4.RX_P
MGTRX113_1_N: J1.23 ; port GBT5.RX_N
MGTRX113_1_P: J1.21 ; port GBT5.RX_P
MGTTX112_0_N: J1.2 ; port GBT0.TX_N
MGTTX112_0_P: J1.4 ; port GBT0.TX_P
MGTTX112_1_N: J1.8 ; port GBT1.TX_N
MGTTX112_1_P: J1.6 ; port GBT1.TX_P
MGTTX112_2_N: J1.12 ; port GBT2.TX_N
MGTTX112_2_P: J1.10 ; port GBT2.TX_P
MGTTX112_3_N: J1.16 ; port GBT3.TX_N
MGTTX112_3_P: J1.14 ; port GBT3.TX_P
MGTTX113_0_N: J1.20 ; port GBT4.TX_N
MGTTX113_0_P: J1.18 ; port GBT4.TX_P
MGTTX113_1_N: J1.24 ; port GBT5.TX_N
MGTTX113_1_P: J1.22 ; port GBT5.TX_P
PB0: J2.57 ; port CPU_IO33_4
PB1: J2.53 ; port CPU_IO33_2
PB2: J2.55 ; port CPU_IO33_3
PB3: J2.51 ; port CPU_IO33_1
PB4: J2.59 ; port CPU_IO33_5
PB5: J2.61 ; port CPU_IO33_6
PB6: J2.49 ; port CPU_IO33_0
PB7: J2.63 ; port CPU_IO33_7
PE0: J2.69 ; port CPU_IO25_10  [project net DETECT]
PE1: J2.75 ; port CPU_IO25_13
PE2: J2.73 ; port CPU_IO25_12
PE3: J2.45 ; port CPU_IO25_6  [project net DETECT]
PE4: J2.43 ; port CPU_IO25_5
PE5: J2.67 ; port CPU_IO25_9
PE6: J2.71 ; port CPU_IO25_11
PE7: J2.77 ; port CPU_IO25_14
PE8: J2.41 ; port CPU_IO25_4  [project net DETECT]
PE9: J2.79 ; port CPU_IO25_15
PE10: J2.33 ; port CPU_IO25_0  [project net DETECT]
PE11: J2.47 ; port CPU_IO25_7
PE12: J2.35 ; port CPU_IO25_1
PE13: J2.39 ; port CPU_IO25_3
PE14: J2.37 ; port CPU_IO25_2  [project net DETECT]
PE15: J2.65 ; port CPU_IO25_8  [project net DETECT]

Not connected (* = marked no-connect by the designer): J1 25 26 27 28 29 30 31 32 33 34 35 36 37 38 39 40 41 42 43 44 45 46 47 48 49 50 51 52 53 54 55 56 57 58 59 60 61 62 63 64 65 66 67 68 69 70 71 72 73 74 75 76 77 78 79 80 82 83 84 85 86 87 88 89 90 91 92 93 94 95 96; J2 1 3 5 7 9 11 13 15 17 19 21 23 25 27 29 31

### Layout directives
differential pair: MGTRX112_0_N, MGTRX112_0_P, MGTRX112_1_N, MGTRX112_1_P, MGTRX112_2_N, MGTRX112_2_P, MGTRX112_3_N, MGTRX112_3_P, MGTRX113_0_N, MGTRX113_0_P, MGTRX113_1_N, MGTRX113_1_P, MGTTX112_0_N, MGTTX112_0_P, MGTTX112_1_N, MGTTX112_1_P, MGTTX112_2_N, MGTTX112_2_P, MGTTX112_3_N, MGTTX112_3_P, MGTTX113_0_N, MGTTX113_0_P, MGTTX113_1_N, MGTTX113_1_P

### Library data of the parts
J1 J2 = QTS-075-01-L-D-A_WRMOD: High Speed Ground Plane Header

## Sheet sfp_wrapper.SchDoc
size A4
Used 6 times, as channels U_sfp_wrapper, U_sfp_wrapper, U_sfp_wrapper, U_sfp_wrapper, U_sfp_wrapper, U_sfp_wrapper. Parts and nets are listed once, with the designators drawn on the sheet.
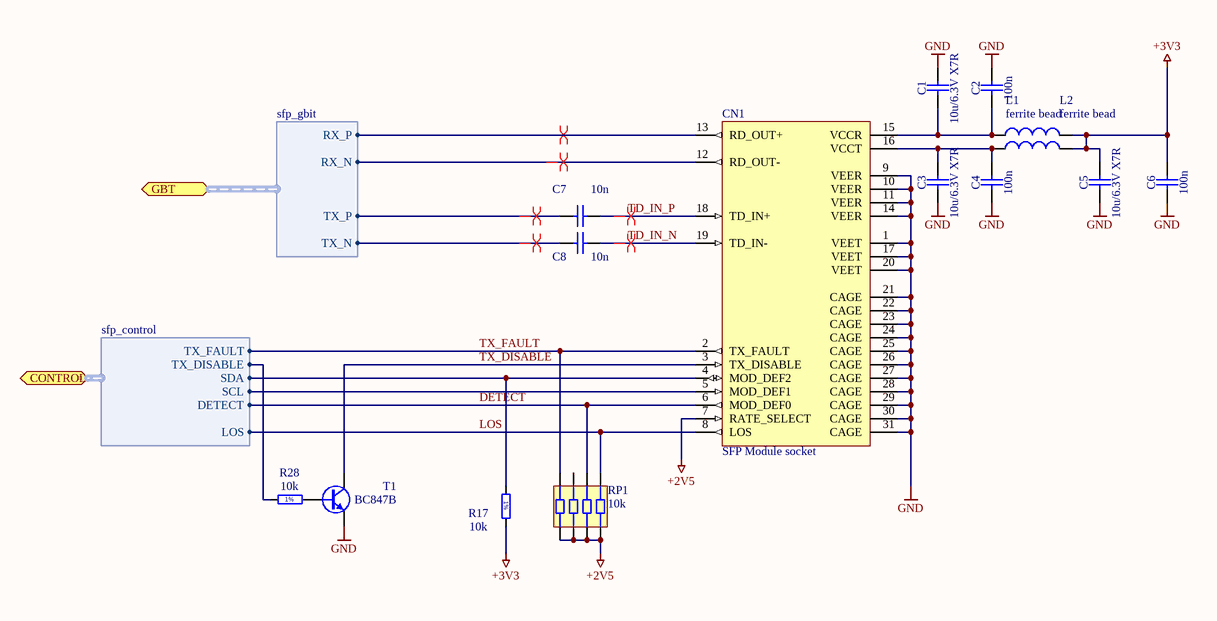
[diagram p3: sfp_wrapper.SchDoc]

### Parts
C1  10u/6.3V X7R  [CAPC3216X140N]
C2  100n  [CAPC1608X87N]
C3  10u/6.3V X7R  [CAPC3216X140N]
C4  100n  [CAPC1608X87N]
C5  10u/6.3V X7R  [CAPC3216X140N]
C6  100n  [CAPC1608X87N]
C7  10n  [CAPC1608X87N]
C8  10n  [CAPC1608X87N]
CN1  SFP Module socket  [SFP_SINGLE_PORT]
L1  value ferrite bead  [INDC2012-0805]  (hidden comment: Inductor)
L2  value ferrite bead  [INDC2012-0805]  (hidden comment: Inductor)
R17  10k  [RESC1608X55N]
R28  10k  [RESC1608X55N]
RP1  10k  [CAY-16]
T1  BC847B  [SOT95P230X110-3N]

### Ports
CONTROL (harness sfp_control), GBT (harness sfp_gbit)

### Harnesses
sfp_gbit: RX_N, RX_P, TX_N, TX_P
sfp_control: DETECT, LOS, SCL, SDA, TX_DISABLE, TX_FAULT

### Nets
+2V5: CN1.7(RATE_SELECT) RP1.1 RP1.2 RP1.3 RP1.4
+3V3: C5.2 C6.2 L1.2 L2.2 R17.2
GND: C1.2 C2.2 C3.1 C4.1 C5.1 C6.1 CN1.1(VEET) CN1.9(VEER) CN1.10(VEER) CN1.11(VEER) CN1.14(VEER) CN1.17(VEET) CN1.20(VEET) CN1.21(CAGE) CN1.22(CAGE) CN1.23(CAGE) CN1.24(CAGE) CN1.25(CAGE) CN1.26(CAGE) CN1.27(CAGE) CN1.28(CAGE) CN1.29(CAGE) CN1.30(CAGE) CN1.31(CAGE) T1.2(E)
DETECT: CN1.6(MOD_DEF0) RP1.6 ; port CONTROL.DETECT
LOS: CN1.8(LOS) RP1.5 ; port CONTROL.LOS
TD_IN_N: C8.2 CN1.19(TD_IN-)
TD_IN_P: C7.2 CN1.18(TD_IN+)
TX_DISABLE: CN1.3(TX_DISABLE) T1.3(C)
TX_FAULT: CN1.2(TX_FAULT) RP1.8 ; port CONTROL.TX_FAULT
NetC1_1: C1.1 C2.1 CN1.15(VCCR) L2.1
NetC3_2: C3.2 C4.2 CN1.16(VCCT) L1.1
NetC7_1: C7.1 ; port GBT.TX_P
NetC8_1: C8.1 ; port GBT.TX_N
NetCN1_4: CN1.4(MOD_DEF2) R17.1 ; port CONTROL.SDA
NetCN1_5: CN1.5(MOD_DEF1) ; port CONTROL.SCL
NetCN1_12: CN1.12(RD_OUT-) ; port GBT.RX_N
NetCN1_13: CN1.13(RD_OUT+) ; port GBT.RX_P
NetR28_1: R28.1 ; port CONTROL.TX_DISABLE
NetR28_2: R28.2 T1.1(B)

Not connected (* = marked no-connect by the designer): RP1 7

### Channels
U_sfp_wrapper: designators end in F
U_sfp_wrapper: designators end in E
U_sfp_wrapper: designators end in D
U_sfp_wrapper: designators end in C
U_sfp_wrapper: designators end in B
U_sfp_wrapper: designators end in A

### Layout directives
differential pair: MGTRX113_1_N, MGTRX113_1_P, MGTTX113_1_N, MGTTX113_1_P, TD_IN_N_U_sfp_wrapper, TD_IN_P_U_sfp_wrapper

### Notes on the sheet
- (in symbol R0603_10K_1%_0.1W_100PPM) 1%

### Library data of the parts
C1 C3 C5 = CC1206_10UF_10V_10%_X7R: Non-polarised capacitor; Part Description: SMD Multilayer Chip Ceramic Capacitor; Manufacturer: GENERIC; Manufacturer1 Part Number: C1206C106K8RAC; Manufacturer1 Datasheet: \\cern.ch\dfs\Applications\Altium\Datasheets\CC1206_X7R_KEMET.pdf; Value: 10uF; Voltage: 10V; Tolerance: ±10%; Table: Capacitors SMD; Part Number: CC1206_10UF_10V_10%_X7R; Component Kind: Standard; Component Type: Standard; Designator: Capacitor - non polarized; Library Reference: Capacitor - non polarized; Pin Count: 2; Status: Preferred; TC: X7R; Manufacturer Part Number: CC1206_10uF_10V_10%_X7R; Case: 1206; Mounted: Yes; Socket: No; SMD: Yes; Manufacturer1 Example: KEMET; Manufacturer1 ComponentHeight: 1.8mm; HelpURL: \\cern.ch\dfs\Applications\Altium\Datasheets\CC1206_X7R_KEMET.pdf; Author: CERN DEM JLC; CreateDate: 12/3/2007; LatestRevisionDate: 12/3/2007
C2 C4 C6 = CC0603_100NF_50V_10%_X7R: Non-polarised capacitor; Part Description: SMD Multilayer Chip Ceramic Capacitor; Manufacturer: GENERIC; Manufacturer1 Part Number: 223858615649; Manufacturer1 Datasheet: \\cern.ch\dfs\Applications\Altium\Datasheets\CC0603_X7R_PHYCOMP.pdf; Value: 100nF; Voltage: 50V; TC: X7R; Tolerance: ±10%; Table: Capacitors SMD; Part Number: CC0603_100NF_50V_10%_X7R; Component Kind: Standard; Component Type: Standard; Designator: Capacitor - non polarized; Library Reference: Capacitor - non polarized; Pin Count: 2; Status: Preferred; Manufacturer Part Number: CC0603_100NF_50V_10%_X7R; Case: 0603; Mounted: Yes; Socket: No; SMD: Yes; Manufacturer1 Example: PHYCOMP; Manufacturer1 ComponentHeight: 0.87mm; HelpURL: \\cern.ch\dfs\Applications\Altium\Datasheets\CC0603_X7R_PHYCOMP.pdf; Author: CERN DEM JLC; CreateDate: 12/3/2007; LatestRevisionDate: 12/3/2007
C7 C8 = CC0603_10NF_50V_10%_X7R: Non-polarised capacitor; Part Description: SMD Multilayer Chip Ceramic Capacitor; Manufacturer: GENERIC; Manufacturer1 Part Number: 223858615636; Value: 10nF; Voltage: 50V; TC: X7R; Tolerance: ±10%; Table: Capacitors SMD; Part Number: CC0603_10NF_50V_10%_X7R; Component Kind: Standard; Component Type: Standard; Pin Count: 2; Status: Preferred; Manufacturer Part Number: CC0603_10NF_50V_10%_X7R; Case: 0603; Mounted: Yes; Socket: No; SMD: Yes; Manufacturer1 Example: PHYCOMP; Manufacturer1 ComponentHeight: 0.87mm; HelpURL: \\cern.ch\dfs\Applications\Altium\Datasheets\CC0603_X7R_PHYCOMP.pdf; Author: CERN DEM JLC; CreateDate: 12/3/2007; LatestRevisionDate: 12/3/2007
CN1 = SFP_SOCKET_SINGLE: Socket for SFP module; RefId: Far/1256176
L1 L2 = Inductor: Ferrite bead; Published: 8-Jun-2000; Revision: July-2002: Re-released for DXP Platform.; Publisher: Altium Limited
R17 R28 = R0603_10K_1%_0.1W_100PPM: Resistor - 1%; Part Description: General Purpose Thick Film Chip Resistor; Manufacturer: GENERIC; Manufacturer1 Part Number: NRC06F1002TRF; Power: 0.1W; TC: ±100ppm/°C; Table: Resistors SMD; Part Number: R0603_10K_1%_0.1W_100PPM; Component Kind: Standard; Component Type: Standard; Pin Count: 2; Value: 10k; Status: Preferred; Tolerance: ±1%; Manufacturer Part Number: R0603_10K_1%_0.1W_100PPM; Case: 0603; Mounted: Yes; Socket: No; SMD: Yes; Manufacturer1 Example: NIC COMPONENT; Manufacturer1 ComponentHeight: 0.55mm; HelpURL: \\cern.ch\dfs\Applications\Altium\Datasheets\R0603_NIC_NRC.pdf; Author: CERN DEM JLC; CreateDate: 12/3/2007; LatestRevisionDate: 3/13/2008
RP1 = RES_ARRAY_1206: Resistor network 1206 (4x0402) Maritex RAC4Xxxx
T1 = BC847B: NPN Transistor; Part Description: 45V, 100mA NPN general-purpose transistors; Manufacturer: NXP SEMICONDUCTORS; Table: Transistors; Part Number: BC847B; Component Kind: Standard; Component Type: Standard; Device: BC847B; PackageDescription: SOT23, 3 pin, Pitch 0.95mm - 1.3mm W X 2.9mm L X 1.1mm H, IPC Medium Density; Manufacturer Part Number: BC847B; Pin Count: 3; Case: SOT23-3; Mounted: Yes; Socket: No; SMD: Yes; ComponentHeight: 1.1mm; HelpURL: \\cern.ch\dfs\Applications\Altium\Datasheets\BC847B.pdf; Author: CERN DEM JLC; CreateDate: 6/14/2011; LatestRevisionDate: 6/14/2011

## Sheet usb_uart.SchDoc
size A
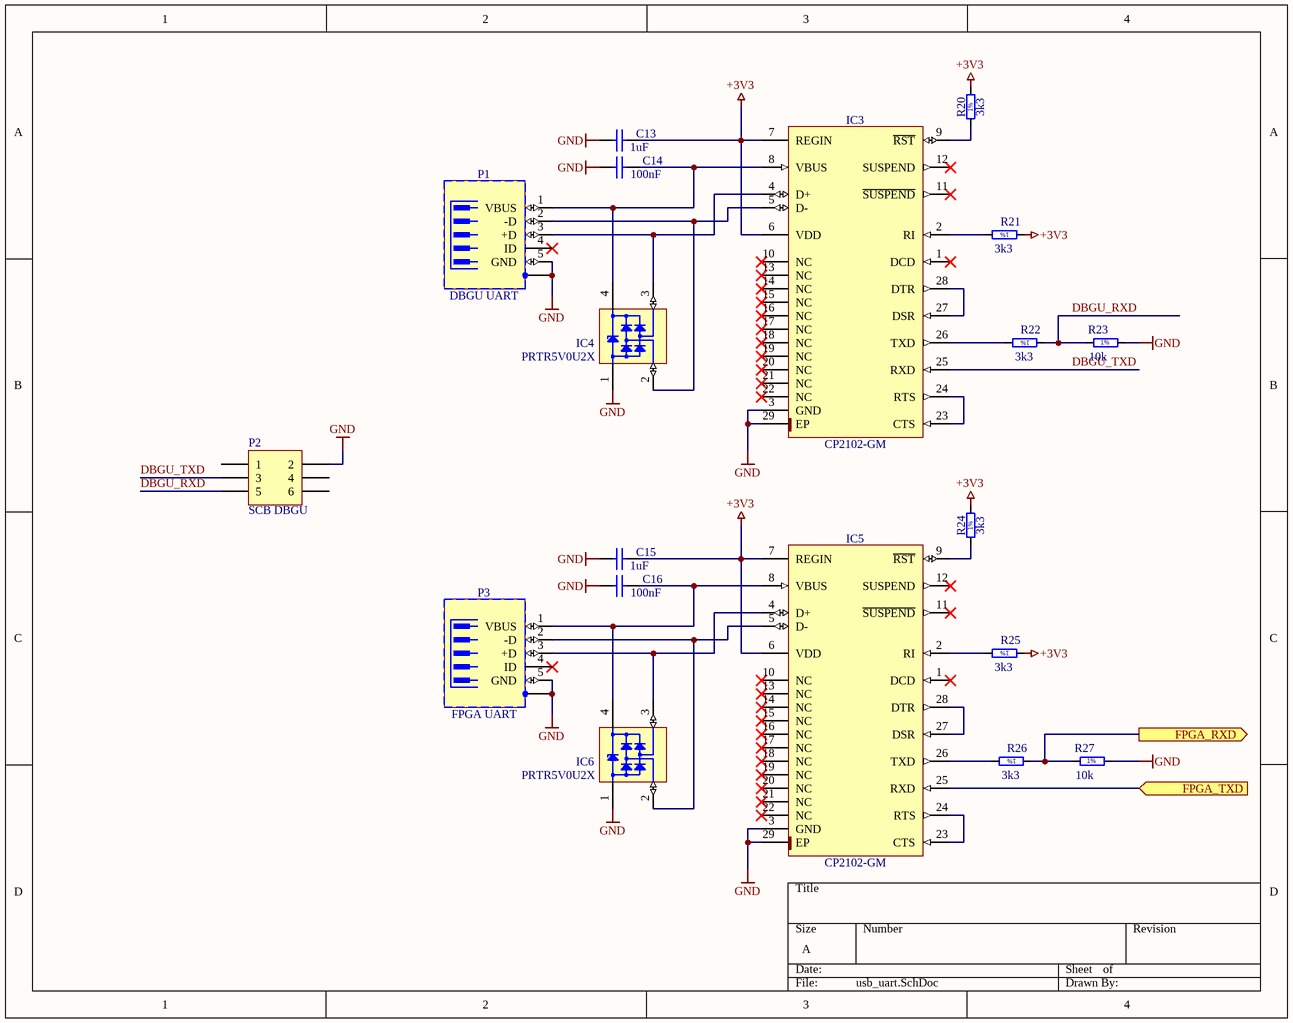
[diagram p4: usb_uart.SchDoc]

### Parts
C13  1uF  [CAPC1608X87N]
C14  100nF  [CAPC1608X87N]
C15  1uF  [CAPC1608X87N]
C16  100nF  [CAPC1608X87N]
IC3  CP2102-GM  [QFN50P500X500X100-29N-S335]
IC4  PRTR5V0U2X  [SOT190P230X110-4N]
IC5  CP2102-GM  [QFN50P500X500X100-29N-S335]
IC6  PRTR5V0U2X  [SOT190P230X110-4N]
P1  DBGU UART  [TYCO_1734035-1]
P2  SCB DBGU  [HDR2X3]
P3  FPGA UART  [TYCO_1734035-1]
R20  3k3  [RESC1608X55N]
R21  3k3  [RESC1608X55N]
R22  3k3  [RESC1608X55N]
R23  10k  [RESC1608X55N]
R24  3k3  [RESC1608X55N]
R25  3k3  [RESC1608X55N]
R26  3k3  [RESC1608X55N]
R27  10k  [RESC1608X55N]

### Ports
FPGA_RXD (out), FPGA_TXD (in)

### Nets
+3V3: C13.1 C15.1 IC3.6(VDD) IC3.7(REGIN) IC5.6(VDD) IC5.7(REGIN) R20.2 R21.1 R24.2 R25.1
GND: C13.2 C14.2 C15.2 C16.2 IC3.3(GND) IC3.29(EP) IC4.1(GND) IC5.3(GND) IC5.29(EP) IC6.1(GND) P1.5(GND) P1.6(SH) P2.2 P3.5(GND) P3.6(SH) R23.2 R27.2
DBGU_RXD: P2.5 R22.1 R23.1
DBGU_TXD: IC3.25(RXD) P2.3
FPGA_RXD: IC5.25(RXD) ; port FPGA_TXD
FPGA_TXD: R26.1 R27.1 ; port FPGA_RXD
NetC14_1: C14.1 IC3.8(VBUS) IC4.4(VCC) P1.1(VBUS)
NetC16_1: C16.1 IC5.8(VBUS) IC6.4(VCC) P3.1(VBUS)
NetIC3_2: IC3.2(RI) R21.2
NetIC3_4: IC3.4(D+) IC4.3(I/O2) P1.3(+D)
NetIC3_5: IC3.5(D-) IC4.2(I/O1) P1.2(-D)
NetIC3_9: IC3.9(~{RST}) R20.1
NetIC3_23: IC3.23(CTS) IC3.24(RTS)
NetIC3_26: IC3.26(TXD) R22.2
NetIC3_27: IC3.27(DSR) IC3.28(DTR)
NetIC5_2: IC5.2(RI) R25.2
NetIC5_4: IC5.4(D+) IC6.3(I/O2) P3.3(+D)
NetIC5_5: IC5.5(D-) IC6.2(I/O1) P3.2(-D)
NetIC5_9: IC5.9(~{RST}) R24.1
NetIC5_23: IC5.23(CTS) IC5.24(RTS)
NetIC5_26: IC5.26(TXD) R26.2
NetIC5_27: IC5.27(DSR) IC5.28(DTR)

Not connected (* = marked no-connect by the designer): IC3 1(DCD)* 10(NC)* 11(~{SUSPEND})* 12(SUSPEND)* 13(NC)* 14(NC)* 15(NC)* 16(NC)* 17(NC)* 18(NC)* 19(NC)* 20(NC)* 21(NC)* 22(NC)*; IC5 1(DCD)* 10(NC)* 11(~{SUSPEND})* 12(SUSPEND)* 13(NC)* 14(NC)* 15(NC)* 16(NC)* 17(NC)* 18(NC)* 19(NC)* 20(NC)* 21(NC)* 22(NC)*; P1 4(ID)*; P2 1 4 6; P3 4(ID)*

### Notes on the sheet
- (in symbol R0603_3K3_1%_0.1W_100PPM) 1%
- (in symbol R0603_10K_1%_0.1W_100PPM) 1%

### Library data of the parts
C13 C15 = CC0603_1UF_16V_10%_X7R: Non-polarised capacitor; Part Description: SMD Multilayer Chip Ceramic Capacitor; Manufacturer: GENERIC; Manufacturer1 Part Number: 223824613663; Voltage: 16V; TC: X7R; Tolerance: ±10%; Table: Capacitors SMD; Part Number: CC0603_1UF_16V_10%_X7R; Component Kind: Standard; Component Type: Standard; Pin Count: 2; Value: 1uF; Status: Preferred; Manufacturer Part Number: CC0603_1uF_16V_10%_X7R; Case: 0603; Mounted: Yes; Socket: No; SMD: Yes; Manufacturer1 Example: PHYCOMP; Manufacturer1 ComponentHeight: 0.87mm; HelpURL: \\cern.ch\dfs\Applications\Altium\Datasheets\CC0805_X5R_PHYCOMP_HC.pdf; Author: CERN DEM JLC; CreateDate: 12/3/2007; LatestRevisionDate: 12/3/2007
C14 C16 = CC0603_100NF_50V_10%_X7R: Non-polarised capacitor; Part Description: SMD Multilayer Chip Ceramic Capacitor; Manufacturer: GENERIC; Manufacturer1 Part Number: 223858615649; Voltage: 50V; TC: X7R; Tolerance: ±10%; Table: Capacitors SMD; Part Number: CC0603_100NF_50V_10%_X7R; Component Kind: Standard; Component Type: Standard; Pin Count: 2; Value: 100nF; Status: Preferred; Manufacturer Part Number: CC0603_100NF_50V_10%_X7R; Case: 0603; Mounted: Yes; Socket: No; SMD: Yes; Manufacturer1 Example: PHYCOMP; Manufacturer1 ComponentHeight: 0.87mm; HelpURL: \\cern.ch\dfs\Applications\Altium\Datasheets\CC0603_X7R_PHYCOMP.pdf; Author: CERN DEM JLC; CreateDate: 03/12/2007; LatestRevisionDate: 03/12/2007
IC3 IC5 = CP2102-GM: Single-Chip USB to UART Bridge; Manufacturer: SILICON LABS; Table: Analog & Interface; Part Number: CP2102-GM; Component Kind: Standard; Component Type: Standard; Device: CP2102-GM; PackageDescription: QFN, 0.50mm Pitch, Square; 28 pin, 5.00mm L X 5.00mm W X 1.00mm H body (w/thermal tab 3.35 X 3.35mm),  IPC Medium Density; Part Description: Single-Chip USB to UART Bridge; Manufacturer Part Number: CP2102-GM; Pin Count: 29; Case: QFN28; Mounted: Yes; Socket: No; SMD: Yes; ComponentHeight: 1.0mm; Author: CERN DEM JLC; HelpURL: \\cern.ch\dfs\Applications\Altium\Datasheets\CP2102-GM.pdf; CreateDate: 3/3/2011; LatestRevisionDate: 3/3/2011
IC4 IC6 = PRTR5V0U2X: Ultra Low Capacitance Double Rail-to-Rail ESD Protection Diode; Part Description: Ultra Low Capacitance (1pF) Double Rail-to-Rail ESD Protection Diode (8kV); Manufacturer: PHILIPS NXP; Voltage: 5.5V; Table: Diodes; Part Number: PRTR5V0U2X; Component Kind: Standard; Component Type: Standard; Device: PRTR5V0U2X; PackageDescription: SOT143B, SOT, 1.90mm Pitch; 4 Pin, 1.30mm W X 2.90mm L X 1.10mm H body, IPC Medium Density; Manufacturer Part Number: PRTR5V0U2X; Pin Count: 4; Case: SOT143B; Mounted: Yes; Socket: No; SMD: Yes; ComponentHeight: 1.1mm; HelpURL: \\cern.ch\dfs\Applications\Altium\Datasheets\PRTR5V0U2X.pdf; Author: CERN DEM JLC; CreateDate: 3/22/2011; LatestRevisionDate: 3/22/2011
P1 P3 = TYCO_1734035-1: 5 Pin + 1 Shield USB Receptacle; Part Description: 5 Position, Right Angle, SMD Mini USB Type B Receptacle; Manufacturer: TYCO ELECTRONICS; Table: TYCO; Part Number: TYCO_1734035-1; Component Kind: Standard; Component Type: Standard; Pin Count: 6; Family: USB; Mounted: Yes; Socket: No; SMD: Yes; Status: None; Manufacturer Part Number: 1734035-1; ComponentHeight: 3.95mm; HelpURL: \\cern.ch\dfs\Applications\Altium\Datasheets\TYCO_1734035-1.pdf; Author: CERN DEM JLC; CreateDate: 02/05/2011; LatestRevisionDate: 02/05/2011
P2 = MHDR2X3: Header, 3-Pin, Dual row, 2.54mm pitch; Manufacturer1: FCI; Value: 75869-131LF; LatestRevisionDate: 17-Jul-2002; LatestRevisionNote: Re-released for DXP Platform.; Publisher: Altium Limited; Distributor1: Digikey; Distributor1 PN: 609-2845-ND
R20-R22 R24-R26 = R0603_3K3_1%_0.1W_100PPM: Resistor - 1%; Part Description: General Purpose Thick Film Chip Resistor; Manufacturer: GENERIC; Manufacturer1 Part Number: NRC06F3301TRF; Power: 0.1W; TC: ±100ppm/°C; Table: Resistors SMD; Part Number: R0603_3K3_1%_0.1W_100PPM; Component Kind: Standard; Component Type: Standard; Pin Count: 2; Value: 3k3; Status: Preferred; Tolerance: ±1%; Manufacturer Part Number: R0603_3K3_1%_0.1W_100PPM; Case: 0603; Mounted: Yes; Socket: No; SMD: Yes; Manufacturer1 Example: NIC COMPONENT; Manufacturer1 ComponentHeight: 0.55mm; HelpURL: \\cern.ch\dfs\Applications\Altium\Datasheets\R0603_NIC_NRC.pdf; Author: CERN DEM JLC; CreateDate: 12/3/2007; LatestRevisionDate: 3/13/2008
R23 R27 = R0603_10K_1%_0.1W_100PPM: as R17 on sheet sfp_wrapper; Part Number: R0603_10K_1%_0.1W_100PPM; Component Kind: Standard; Component Type: Standard; Pin Count: 2; Value: 10k; Status: Preferred; Tolerance: ±1%; Manufacturer Part Number: R0603_10K_1%_0.1W_100PPM; Case: 0603; Mounted: Yes; Socket: No; SMD: Yes; Manufacturer1 Example: NIC COMPONENT; Manufacturer1 ComponentHeight: 0.55mm; HelpURL: \\cern.ch\dfs\Applications\Altium\Datasheets\R0603_NIC_NRC.pdf; Author: CERN DEM JLC; CreateDate: 12/3/2007; LatestRevisionDate: 3/13/2008

## Nets that join several sheets
+2V5: scb_connectors (J1.81), U_sfp_wrapper (5 pins), U_sfp_wrapper (5 pins), U_sfp_wrapper (5 pins), U_sfp_wrapper (5 pins), U_sfp_wrapper (5 pins), U_sfp_wrapper (5 pins)
+3V3: power_supply (C10.1 IC1.6), U_sfp_wrapper (5 pins), U_sfp_wrapper (5 pins), U_sfp_wrapper (5 pins), U_sfp_wrapper (5 pins), U_sfp_wrapper (5 pins), U_sfp_wrapper (5 pins), usb_uart (10 pins)
+5V: power_supply (C12.1 IC2.6), scb_connectors (12 pins)
GND: mini_backplane (16 pins), power_supply (11 pins), scb_connectors (28 pins), U_sfp_wrapper (25 pins), U_sfp_wrapper (25 pins), U_sfp_wrapper (25 pins), U_sfp_wrapper (25 pins), U_sfp_wrapper (25 pins), U_sfp_wrapper (25 pins), usb_uart (17 pins)
DETECT: scb_connectors (J2.33), U_sfp_wrapper (CN1F.6 RP1F.6)
DETECT: scb_connectors (J2.37), U_sfp_wrapper (CN1E.6 RP1E.6)
DETECT: scb_connectors (J2.41), U_sfp_wrapper (CN1D.6 RP1D.6)
DETECT: scb_connectors (J2.45), U_sfp_wrapper (CN1C.6 RP1C.6)
DETECT: scb_connectors (J2.65), U_sfp_wrapper (CN1B.6 RP1B.6)
DETECT: scb_connectors (J2.69), U_sfp_wrapper (CN1A.6 RP1A.6)
FPGA_GPIO0: mini_backplane (R1.1), scb_connectors (J2.2)
FPGA_GPIO1: mini_backplane (R2.1), scb_connectors (J2.4)
FPGA_GPIO2: mini_backplane (R3.1), scb_connectors (J2.6)
FPGA_GPIO3: mini_backplane (R4.1), scb_connectors (J2.8)
FPGA_GPIO4: mini_backplane (R5.1), scb_connectors (J2.10)
FPGA_GPIO5: mini_backplane (R6.1), scb_connectors (J2.12)
FPGA_GPIO6: mini_backplane (R7.1), scb_connectors (J2.14)
FPGA_GPIO7: mini_backplane (R8.1), scb_connectors (J2.16)
FPGA_GPIO8: mini_backplane (R9.1), scb_connectors (J2.18)
FPGA_GPIO9: mini_backplane (R10.1), scb_connectors (J2.20)
FPGA_GPIO10: mini_backplane (R11.1), scb_connectors (J2.22)
FPGA_GPIO11: mini_backplane (R12.1), scb_connectors (J2.24)
FPGA_GPIO12: mini_backplane (R13.1), scb_connectors (J2.26)
FPGA_GPIO13: mini_backplane (R14.1), scb_connectors (J2.28)
FPGA_GPIO14: mini_backplane (R15.1), scb_connectors (J2.30)
FPGA_GPIO15: mini_backplane (R16.1), scb_connectors (J2.32)
FPGA_GPIO20: scb_connectors (J2.42), U_sfp_wrapper (CN1A.2 RP1A.8)
FPGA_GPIO21: scb_connectors (J2.44), U_sfp_wrapper (R28A.1)
FPGA_GPIO22: scb_connectors (J2.46), U_sfp_wrapper (CN1A.8 RP1A.5)
FPGA_GPIO23: scb_connectors (J2.48), U_sfp_wrapper (CN1B.2 RP1B.8)
FPGA_GPIO24: scb_connectors (J2.50), U_sfp_wrapper (R28B.1)
FPGA_GPIO25: scb_connectors (J2.52), U_sfp_wrapper (CN1B.8 RP1B.5)
FPGA_GPIO26: scb_connectors (J2.54), U_sfp_wrapper (CN1C.2 RP1C.8)
FPGA_GPIO27: scb_connectors (J2.56), U_sfp_wrapper (R28C.1)
FPGA_GPIO28: scb_connectors (J2.58), U_sfp_wrapper (CN1C.8 RP1C.5)
FPGA_GPIO29: scb_connectors (J2.60), U_sfp_wrapper (CN1D.2 RP1D.8)
FPGA_GPIO30: scb_connectors (J2.62), U_sfp_wrapper (R28D.1)
FPGA_GPIO31: scb_connectors (J2.64), U_sfp_wrapper (CN1D.8 RP1D.5)
FPGA_GPIO32: scb_connectors (J2.66), U_sfp_wrapper (CN1E.2 RP1E.8)
FPGA_GPIO33: scb_connectors (J2.68), U_sfp_wrapper (R28E.1)
FPGA_GPIO34: scb_connectors (J2.70), U_sfp_wrapper (CN1E.8 RP1E.5)
FPGA_GPIO35: scb_connectors (J2.72), U_sfp_wrapper (CN1F.2 RP1F.8)
FPGA_GPIO36: scb_connectors (J2.74), U_sfp_wrapper (R28F.1)
FPGA_GPIO37: scb_connectors (J2.76), U_sfp_wrapper (CN1F.8 RP1F.5)
FPGA_RXD: scb_connectors (J2.78), usb_uart (IC5.25)
FPGA_TXD: scb_connectors (J2.80), usb_uart (R26.1 R27.1)
MGTRX112_0_N: scb_connectors (J1.3), U_sfp_wrapper (CN1A.12)
MGTRX112_0_P: scb_connectors (J1.1), U_sfp_wrapper (CN1A.13)
MGTRX112_1_N: scb_connectors (J1.7), U_sfp_wrapper (CN1B.12)
MGTRX112_1_P: scb_connectors (J1.5), U_sfp_wrapper (CN1B.13)
MGTRX112_2_N: scb_connectors (J1.11), U_sfp_wrapper (CN1C.12)
MGTRX112_2_P: scb_connectors (J1.9), U_sfp_wrapper (CN1C.13)
MGTRX112_3_N: scb_connectors (J1.15), U_sfp_wrapper (CN1D.12)
MGTRX112_3_P: scb_connectors (J1.13), U_sfp_wrapper (CN1D.13)
MGTRX113_0_N: scb_connectors (J1.19), U_sfp_wrapper (CN1E.12)
MGTRX113_0_P: scb_connectors (J1.17), U_sfp_wrapper (CN1E.13)
MGTRX113_1_N: scb_connectors (J1.23), U_sfp_wrapper (CN1F.12)
MGTRX113_1_P: scb_connectors (J1.21), U_sfp_wrapper (CN1F.13)
MGTTX112_0_N: scb_connectors (J1.2), U_sfp_wrapper (C8A.1)
MGTTX112_0_P: scb_connectors (J1.4), U_sfp_wrapper (C7A.1)
MGTTX112_1_N: scb_connectors (J1.8), U_sfp_wrapper (C8B.1)
MGTTX112_1_P: scb_connectors (J1.6), U_sfp_wrapper (C7B.1)
MGTTX112_2_N: scb_connectors (J1.12), U_sfp_wrapper (C8C.1)
MGTTX112_2_P: scb_connectors (J1.10), U_sfp_wrapper (C7C.1)
MGTTX112_3_N: scb_connectors (J1.16), U_sfp_wrapper (C8D.1)
MGTTX112_3_P: scb_connectors (J1.14), U_sfp_wrapper (C7D.1)
MGTTX113_0_N: scb_connectors (J1.20), U_sfp_wrapper (C8E.1)
MGTTX113_0_P: scb_connectors (J1.18), U_sfp_wrapper (C7E.1)
MGTTX113_1_N: scb_connectors (J1.24), U_sfp_wrapper (C8F.1)
MGTTX113_1_P: scb_connectors (J1.22), U_sfp_wrapper (C7F.1)
PB0: scb_connectors (J2.57), U_sfp_wrapper (CN1B.4 R17B.1)
PB1: scb_connectors (J2.53), U_sfp_wrapper (CN1D.4 R17D.1)
PB2: scb_connectors (J2.55), U_sfp_wrapper (CN1C.4 R17C.1)
PB3: scb_connectors (J2.51), U_sfp_wrapper (CN1E.4 R17E.1)
PB4: scb_connectors (J2.59), U_sfp_wrapper (CN1A.4 R17A.1)
PB6: scb_connectors (J2.49), U_sfp_wrapper (CN1F.4 R17F.1)
PE4: scb_connectors (J2.43), U_sfp_wrapper (CN1D.5)
PE5: scb_connectors (J2.67), U_sfp_wrapper (CN1B.5)
PE6: scb_connectors (J2.71), U_sfp_wrapper (CN1A.5)
PE11: scb_connectors (J2.47), U_sfp_wrapper (CN1C.5)
PE12: scb_connectors (J2.35), U_sfp_wrapper (CN1F.5)
PE13: scb_connectors (J2.39), U_sfp_wrapper (CN1E.5)